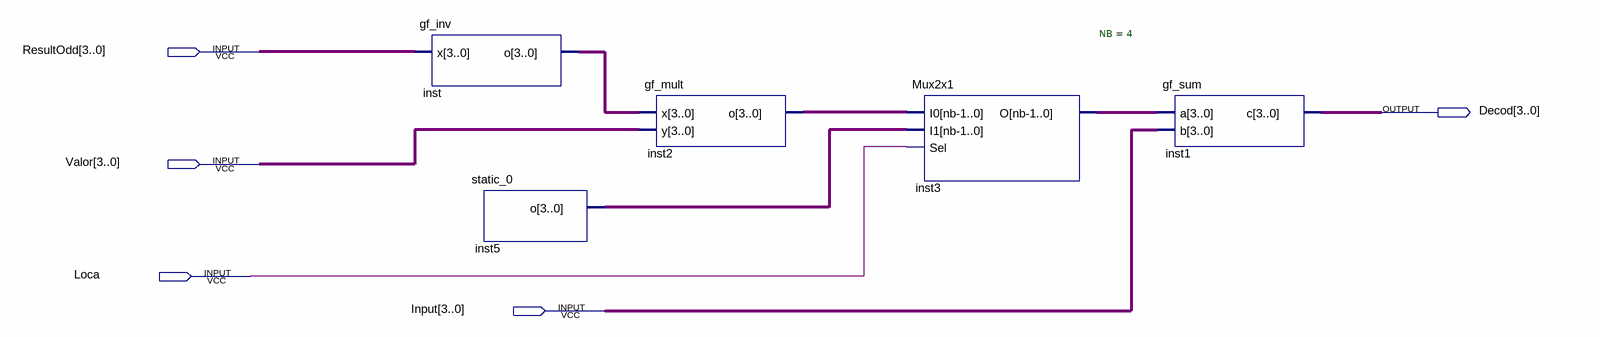
[diagram p0: schematic sheet]
// Quartus schematic Forney.bdf as structural Verilog: 5 symbols, 5 pins
module Forney (
  input  [3:0] ResultOdd,
  input  [3:0] Valor,
  input  Loca,
  input  [3:0] Input,
  output [3:0] Decod
);

  wire [3:0] inst2_o, inst3_o, inst5_o, inst_o;

  gf_inv inst (.x(ResultOdd), .o(inst_o));
  static_0 inst5 (.o(inst5_o));
  gf_mult inst2 (.x(inst_o), .y(Valor), .o(inst2_o));
  Mux2x1 #(.NB(4)) inst3 (.I0(inst2_o), .I1(inst5_o), .Sel(Loca), .O(inst3_o));
  gf_sum inst1 (.a(inst3_o), .b(Input), .c(Decod));
endmodule
